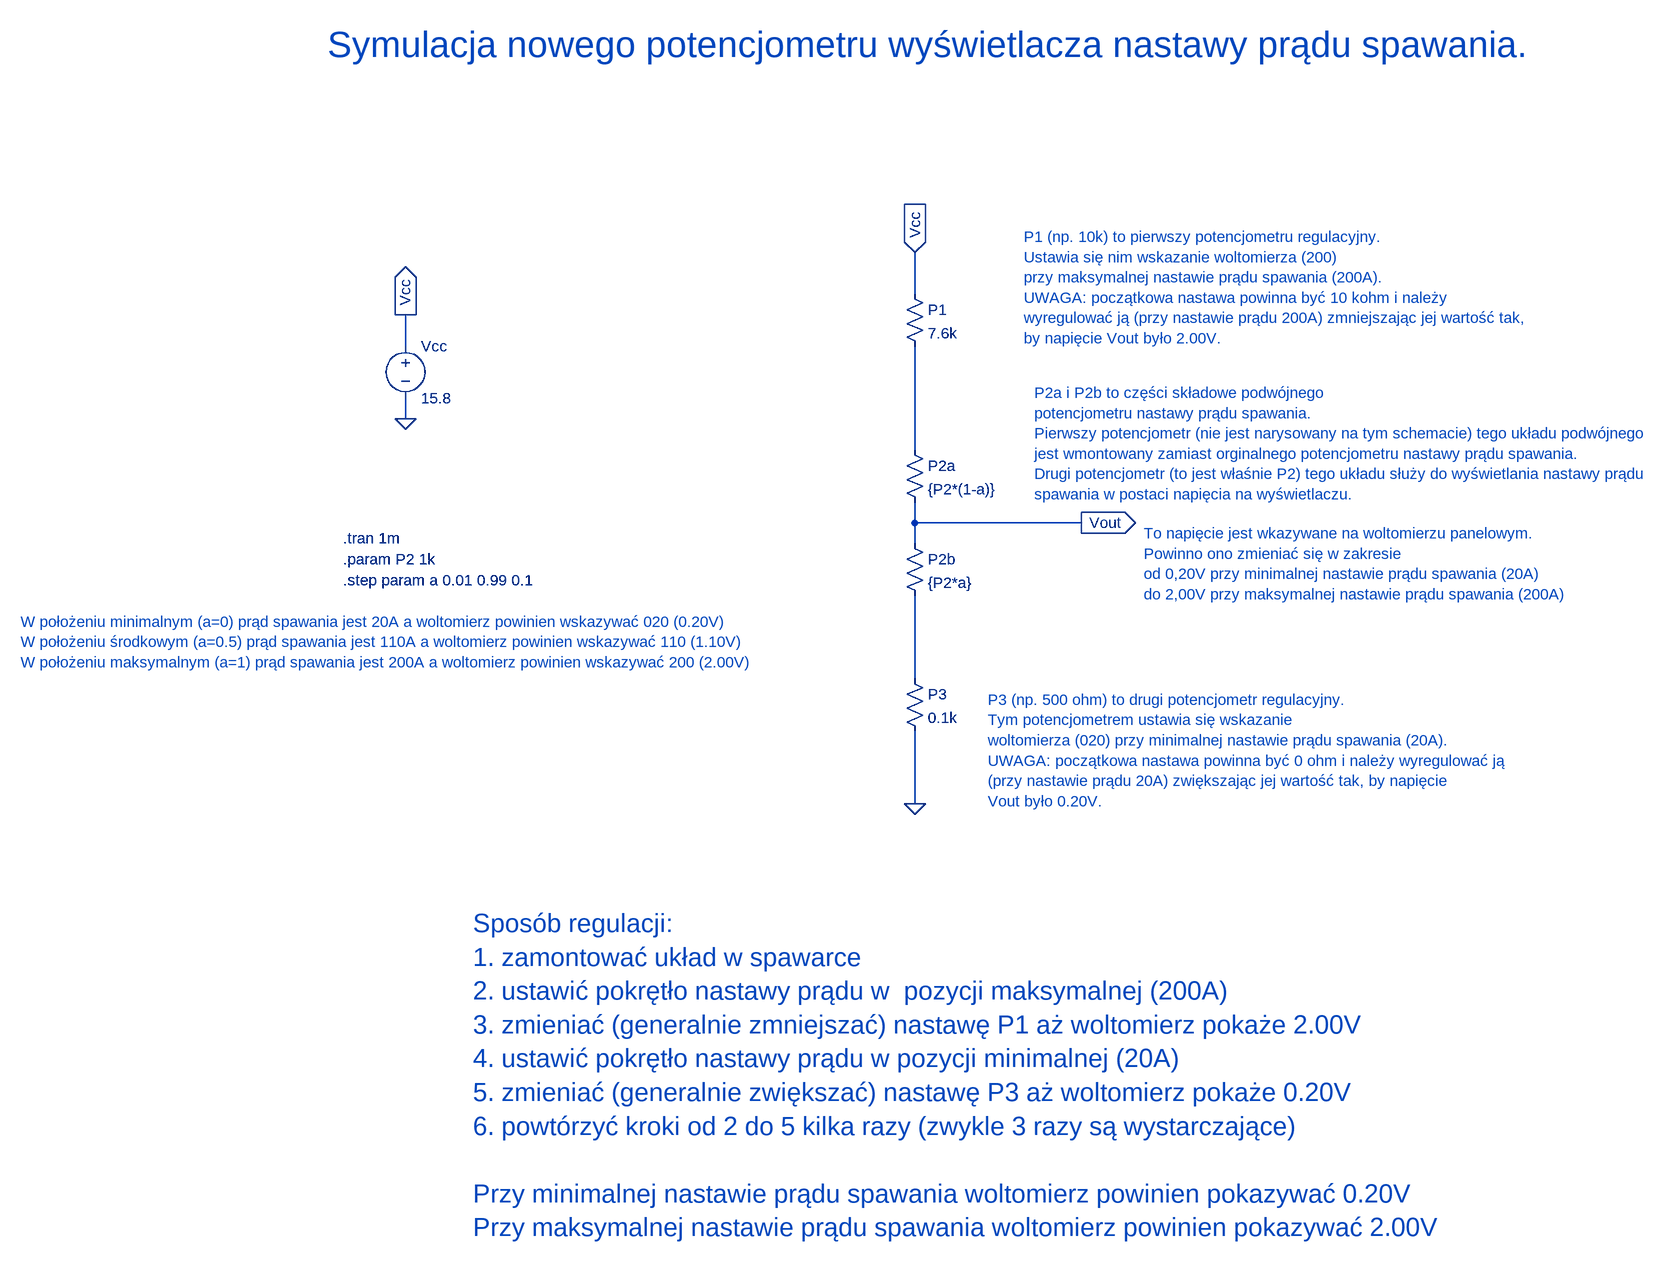
[diagram p0: schematic add_display_potentiometer.asc]
add_display_potentiometer.asc, the LTspice schematic file:
Version 4
SHEET 1 2548 1472
WIRE 768 -16 768 -80
WIRE -16 64 -16 16
WIRE -16 176 -16 144
WIRE 768 224 768 64
WIRE 768 336 768 304
WIRE 1024 336 768 336
WIRE 768 368 768 336
WIRE 768 576 768 448
WIRE 768 768 768 656
FLAG -16 176 0
FLAG -16 16 Vcc
IOPIN -16 16 Out
FLAG 768 -80 Vcc
IOPIN 768 -80 In
FLAG 768 768 0
FLAG 1024 336 Vout
IOPIN 1024 336 Out
SYMBOL voltage -16 48 R0
WINDOW 123 0 0 Left 0
WINDOW 39 0 0 Left 0
SYMATTR InstName Vcc
SYMATTR Value 15.8
SYMBOL res 752 -32 R0
SYMATTR InstName P1
SYMATTR Value 7.6k
SYMBOL res 752 208 R0
SYMATTR InstName P2a
SYMATTR Value {P2*(1-a)}
SYMBOL res 752 352 R0
SYMATTR InstName P2b
SYMATTR Value {P2*a}
SYMBOL res 752 560 R0
SYMATTR InstName P3
SYMATTR Value 0.1k
TEXT -112 424 Left 2 !.step param a 0.01 0.99 0.1
TEXT -112 392 Left 2 !.param P2 1k
TEXT -112 360 Left 2 !.tran 1m
TEXT 936 -104 Left 2 ;P1 (np. 10k) to pierwszy potencjometru regulacyjny.\nUstawia się nim wskazanie woltomierza (200) \nprzy maksymalnej nastawie prądu spawania (200A).\nUWAGA: początkowa nastawa powinna być 10 kohm i należy\nwyregulować ją (przy nastawie prądu 200A) zmniejszając jej wartość tak,\nby napięcie Vout było 2.00V.
TEXT 952 136 Left 2 ;P2a i P2b to części składowe podwójnego \npotencjometru nastawy prądu spawania.\nPierwszy potencjometr (nie jest narysowany na tym schemacie) tego układu podwójnego\njest wmontowany zamiast orginalnego potencjometru nastawy prądu spawania.\nDrugi potencjometr (to jest właśnie P2) tego układu służy do wyświetlania nastawy prądu\nspawania w postaci napięcia na wyświetlaczu.
TEXT 880 608 Left 2 ;P3 (np. 500 ohm) to drugi potencjometr regulacyjny.\nTym potencjometrem ustawia się wskazanie \nwoltomierza (020) przy minimalnej nastawie prądu spawania (20A).\nUWAGA: początkowa nastawa powinna być 0 ohm i należy wyregulować ją\n(przy nastawie prądu 20A) zwiększając jej wartość tak, by napięcie\nVout było 0.20V.
TEXT 1120 352 Left 2 ;To napięcie jest wkazywane na woltomierzu panelowym.\nPowinno ono zmieniać się w zakresie \nod 0,20V przy minimalnej nastawie prądu spawania (20A)\ndo 2,00V przy maksymalnej nastawie prądu spawania (200A)
TEXT -608 488 Left 2 ;W położeniu minimalnym (a=0) prąd spawania jest 20A a woltomierz powinien wskazywać 020 (0.20V)\nW położeniu środkowym (a=0.5) prąd spawania jest 110A a woltomierz powinien wskazywać 110 (1.10V)\nW położeniu maksymalnym (a=1) prąd spawania jest 200A a woltomierz powinien wskazywać 200 (2.00V)
TEXT -136 -400 Left 5 ;Symulacja nowego potencjometru wyświetlacza nastawy prądu spawania.
TEXT 88 952 Left 4 ;Sposób regulacji:\n1. zamontować układ w spawarce\n2. ustawić pokrętło nastawy prądu w  pozycji maksymalnej (200A)\n3. zmieniać (generalnie zmniejszać) nastawę P1 aż woltomierz pokaże 2.00V\n4. ustawić pokrętło nastawy prądu w pozycji minimalnej (20A)\n5. zmieniać (generalnie zwiększać) nastawę P3 aż woltomierz pokaże 0.20V\n6. powtórzyć kroki od 2 do 5 kilka razy (zwykle 3 razy są wystarczające)\n \nPrzy minimalnej nastawie prądu spawania woltomierz powinien pokazywać 0.20V\nPrzy maksymalnej nastawie prądu spawania woltomierz powinien pokazywać 2.00V

The netlist it stands for:
* add_display_potentiometer.asc
Vcc Vcc 0 15.8
R§P1 Vcc N001 7.6k
R§P2a N001 Vout {P2*(1-a)}
R§P2b Vout N002 {P2*a}
R§P3 N002 0 0.1k
.step param a 0.01 0.99 0.1
.param P2 1k
.tran 1m
* P1 (np. 10k) to pierwszy potencjometru regulacyjny.
* Ustawia się nim wskazanie woltomierza (200)
* przy maksymalnej nastawie prądu spawania (200A).
* UWAGA: początkowa nastawa powinna być 10 kohm i należy
* wyregulować ją (przy nastawie prądu 200A) zmniejszając jej wartość tak,
* by napięcie Vout było 2.00V.
* P2a i P2b to części składowe podwójnego
* potencjometru nastawy prądu spawania.
* Pierwszy potencjometr (nie jest narysowany na tym schemacie) tego układu podwójnego
* jest wmontowany zamiast orginalnego potencjometru nastawy prądu spawania.
* Drugi potencjometr (to jest właśnie P2) tego układu służy do wyświetlania nastawy prądu
* spawania w postaci napięcia na wyświetlaczu.
* P3 (np. 500 ohm) to drugi potencjometr regulacyjny.
* Tym potencjometrem ustawia się wskazanie
* woltomierza (020) przy minimalnej nastawie prądu spawania (20A).
* UWAGA: początkowa nastawa powinna być 0 ohm i należy wyregulować ją
* (przy nastawie prądu 20A) zwiększając jej wartość tak, by napięcie
* Vout było 0.20V.
* To napięcie jest wkazywane na woltomierzu panelowym.
* Powinno ono zmieniać się w zakresie
* od 0,20V przy minimalnej nastawie prądu spawania (20A)
* do 2,00V przy maksymalnej nastawie prądu spawania (200A)
* W położeniu minimalnym (a=0) prąd spawania jest 20A a woltomierz powinien wskazywać 020 (0.20V)
* W położeniu środkowym (a=0.5) prąd spawania jest 110A a woltomierz powinien wskazywać 110 (1.10V)
* W położeniu maksymalnym (a=1) prąd spawania jest 200A a woltomierz powinien wskazywać 200 (2.00V)
* Symulacja nowego potencjometru wyświetlacza nastawy prądu spawania.
* Sposób regulacji:
* 1. zamontować układ w spawarce
* 2. ustawić pokrętło nastawy prądu w  pozycji maksymalnej (200A)
* 3. zmieniać (generalnie zmniejszać) nastawę P1 aż woltomierz pokaże 2.00V
* 4. ustawić pokrętło nastawy prądu w pozycji minimalnej (20A)
* 5. zmieniać (generalnie zwiększać) nastawę P3 aż woltomierz pokaże 0.20V
* 6. powtórzyć kroki od 2 do 5 kilka razy (zwykle 3 razy są wystarczające)
* Przy minimalnej nastawie prądu spawania woltomierz powinien pokazywać 0.20V
* Przy maksymalnej nastawie prądu spawania woltomierz powinien pokazywać 2.00V
.backanno
.end